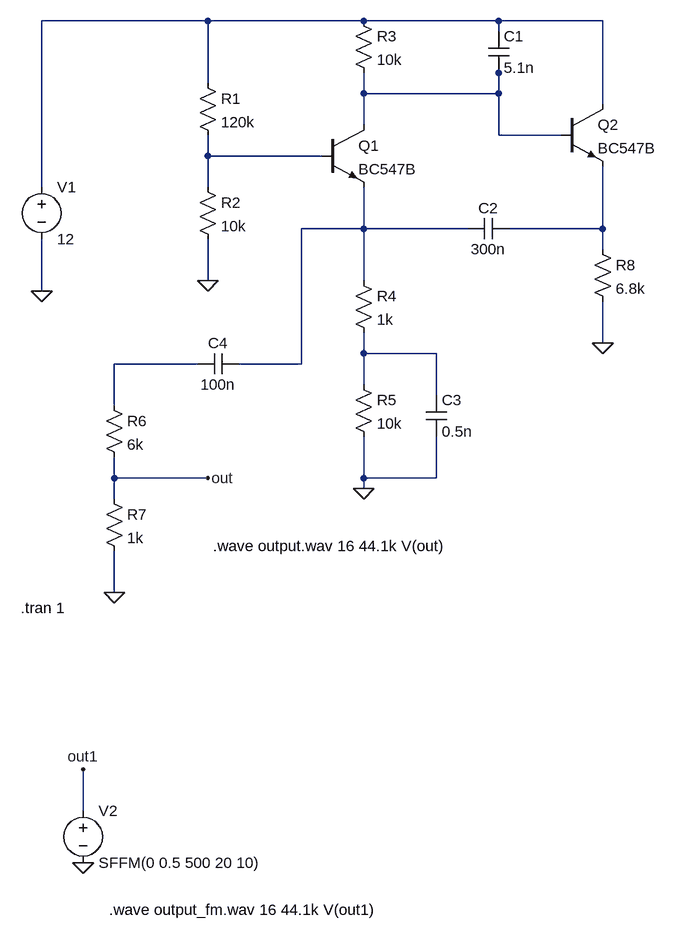
[diagram p0: schematic Draft2.asc]
Draft2.asc, the LTspice schematic file:
Version 4
SHEET 1 1880 1368
WIRE -160 -16 -416 -16
WIRE 80 -16 -160 -16
WIRE 288 -16 80 -16
WIRE 448 -16 288 -16
WIRE 288 0 288 -16
WIRE 288 64 288 48
WIRE -160 80 -160 -16
WIRE 80 96 80 64
WIRE 288 96 288 64
WIRE 288 96 80 96
WIRE 448 112 448 -16
WIRE 80 144 80 96
WIRE 288 160 288 96
WIRE 384 160 288 160
WIRE -160 192 -160 160
WIRE 16 192 -160 192
WIRE -416 240 -416 -16
WIRE -160 240 -160 192
WIRE 80 304 80 240
WIRE 80 304 -16 304
WIRE 240 304 80 304
WIRE 448 304 448 208
WIRE 448 304 304 304
WIRE 448 336 448 304
WIRE -160 384 -160 320
WIRE 80 384 80 304
WIRE -416 400 -416 320
WIRE 448 480 448 416
WIRE 80 496 80 464
WIRE 192 496 80 496
WIRE -176 512 -304 512
WIRE -16 512 -16 304
WIRE -16 512 -112 512
WIRE 80 544 80 496
WIRE 192 560 192 496
WIRE -304 576 -304 512
WIRE -304 688 -304 656
WIRE -160 688 -304 688
WIRE 80 688 80 624
WIRE 192 688 192 624
WIRE 192 688 80 688
WIRE 80 704 80 688
WIRE -304 720 -304 688
WIRE -304 864 -304 800
WIRE -352 1200 -352 1136
FLAG -160 384 0
FLAG -416 400 0
FLAG -304 864 0
FLAG 80 704 0
FLAG 448 480 0
FLAG -160 688 out
FLAG -352 1280 0
FLAG -352 1136 out1
SYMBOL voltage -416 224 R0
WINDOW 123 0 0 Left 0
WINDOW 39 0 0 Left 0
SYMATTR InstName V1
SYMATTR Value 12
SYMBOL res -176 64 R0
SYMATTR InstName R1
SYMATTR Value 120k
SYMBOL res -176 224 R0
SYMATTR InstName R2
SYMATTR Value 10k
SYMBOL res 64 -32 R0
SYMATTR InstName R3
SYMATTR Value 10k
SYMBOL res 64 368 R0
SYMATTR InstName R4
SYMATTR Value 1k
SYMBOL res 64 528 R0
SYMATTR InstName R5
SYMATTR Value 10k
SYMBOL res -320 560 R0
SYMATTR InstName R6
SYMATTR Value 6k
SYMBOL res -320 704 R0
SYMATTR InstName R7
SYMATTR Value 1k
SYMBOL cap 272 0 R0
SYMATTR InstName C1
SYMATTR Value 5.1n
SYMBOL cap 304 288 R90
WINDOW 0 0 32 VBottom 2
WINDOW 3 32 32 VTop 2
SYMATTR InstName C2
SYMATTR Value 300n
SYMBOL npn 16 144 R0
SYMATTR InstName Q1
SYMATTR Value BC547B
SYMBOL npn 384 112 R0
SYMATTR InstName Q2
SYMATTR Value BC547B
SYMBOL res 432 320 R0
SYMATTR InstName R8
SYMATTR Value 6.8k
SYMBOL cap 176 560 R0
SYMATTR InstName C3
SYMATTR Value 0.5n
SYMBOL cap -112 496 R90
WINDOW 0 0 32 VBottom 2
WINDOW 3 32 32 VTop 2
SYMATTR InstName C4
SYMATTR Value 100n
SYMBOL voltage -352 1184 R0
WINDOW 123 0 0 Left 0
WINDOW 39 0 0 Left 0
SYMATTR InstName V2
SYMATTR Value SFFM(0 0.5 500 20 10)
TEXT -448 888 Left 2 !.tran 1
TEXT -152 792 Left 2 !.wave output.wav 16 44.1k V(out)
TEXT -312 1352 Left 2 !.wave output_fm.wav 16 44.1k V(out1)

The netlist it stands for:
* Draft2.asc
V1 N001 0 12
R1 N001 N003 120k
R2 N003 0 10k
R3 N001 N002 10k
R4 N004 N006 1k
R5 N006 0 10k
R6 N007 out 6k
R7 out 0 1k
C1 N001 N002 5.1n
C2 N005 N004 300n
Q1 N002 N003 N004 0 BC547B
Q2 N001 N002 N005 0 BC547B
R8 N005 0 6.8k
C3 N006 0 0.5n
C4 N004 N007 100n
V2 out1 0 SFFM(0 0.5 500 20 10)
.model NPN NPN
.model PNP PNP
.lib standard.bjt
.tran 1
.wave output.wav 16 44.1k V(out)
.wave output_fm.wav 16 44.1k V(out1)
.backanno
.end